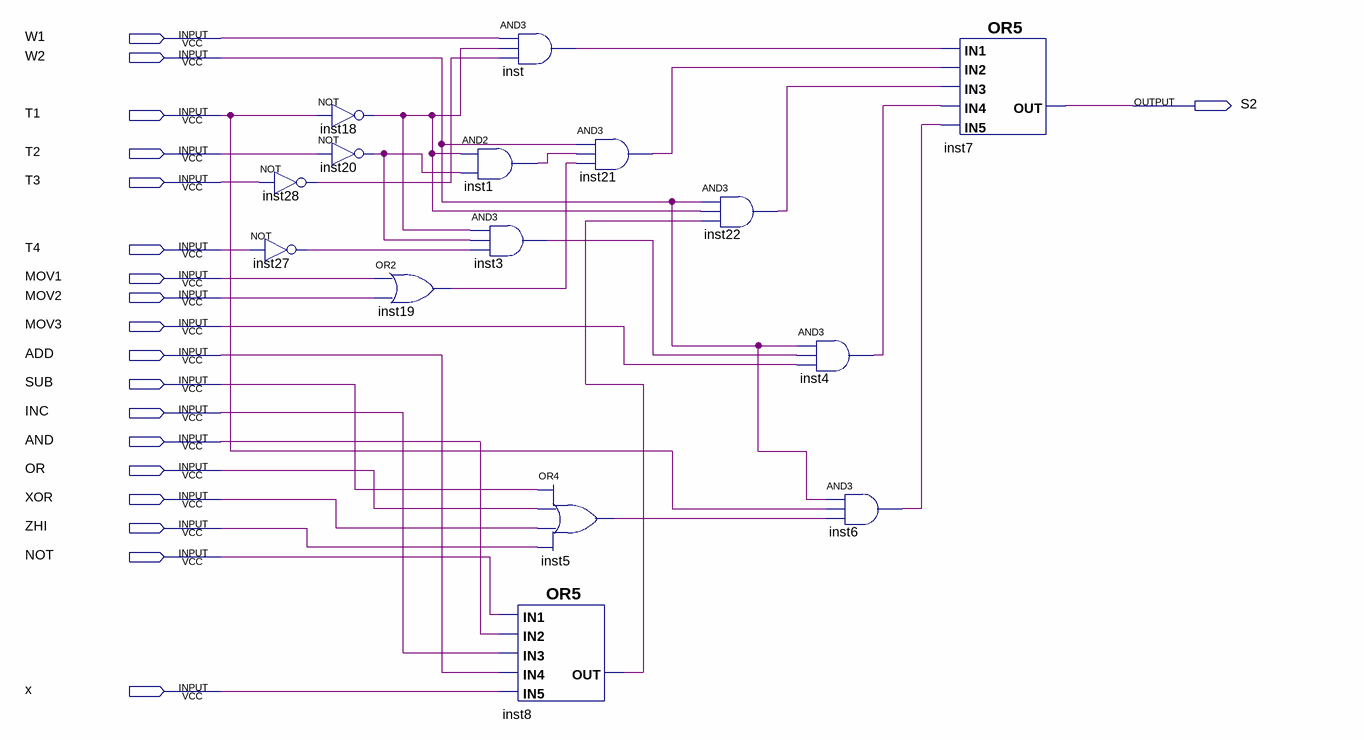
[diagram p0: schematic sheet]
// Quartus schematic S2.bdf as structural Verilog: 15 symbols, 19 pins
module S2 (
  input  W1,
  input  W2,
  input  T1,
  input  T2,
  input  T3,
  input  T4,
  input  MOV1,
  input  MOV2,
  input  MOV3,
  input  ADD,
  input  SUB,
  input  INC,
  input  AND,
  input  OR,
  input  XOR,
  input  ZHI,
  input  NOT,
  input  x,
  output S2
);

  wire inst1_out, inst3_out, inst4_out, inst5_out, inst6_out, inst8_out, inst18_out, inst19_out, inst20_out,
       inst21_out, inst22_out, inst27_out, inst28_out, inst_out;

  not inst28 (inst28_out, T3);
  not inst27 (inst27_out, T4);
  not inst18 (inst18_out, T1);
  not inst20 (inst20_out, T2);
  or inst19 (inst19_out, MOV1, MOV2);
  and inst (inst_out, W1, inst18_out, inst28_out);
  and inst1 (inst1_out, inst18_out, inst20_out);
  and inst3 (inst3_out, inst18_out, inst20_out, inst27_out);
  or inst8 (inst8_out, NOT, AND, INC, ADD, x);
  and inst21 (inst21_out, W2, inst1_out, inst19_out);
  or inst5 (inst5_out, SUB, OR, XOR, ZHI);
  and inst22 (inst22_out, W2, inst18_out, inst8_out);
  and inst4 (inst4_out, W2, inst3_out, MOV3);
  and inst6 (inst6_out, W2, T1, inst5_out);
  or inst7 (S2, inst_out, inst21_out, inst22_out, inst4_out, inst6_out);
endmodule
